# Altium schematic sheet XC7A35TFTG256_bank35.SchDoc
size A4; DocumentNumber: 20; SheetNumber: 20; SheetTotal: 21; SheetName: FPGA Bank 35
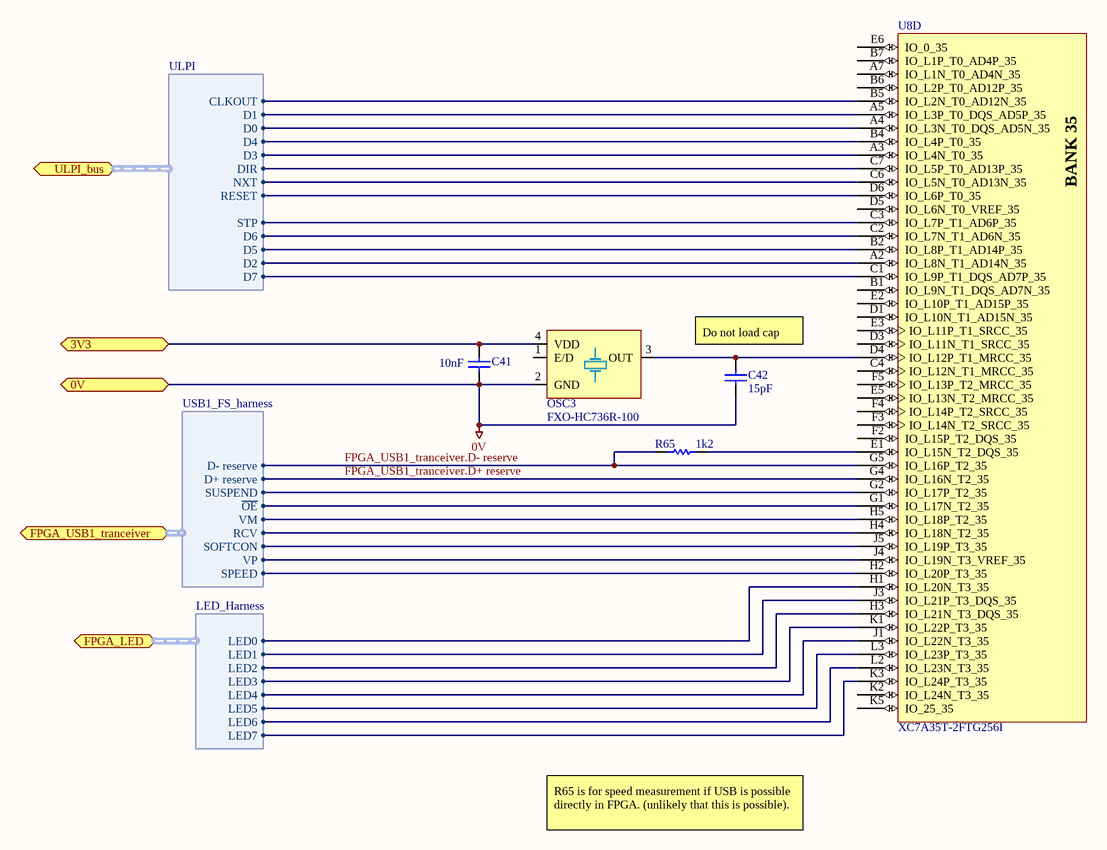
[diagram p0: XC7A35TFTG256_bank35.SchDoc]

## Parts
C41  value 10nF  [CAPC0603(1608)100_L]  (hidden comment: CAP 10nF 16V 0603(1608))
C42  value 15pF  [CAPC0603(1608)100_N]  (hidden comment: CAP 15pF 16V 0603(1608))
OSC3  FXO-HC736R-100  [FXO-HC73]
R65  value 1k2  [RESC0603(1608)_M]  (hidden comment: 1K2 1% 0603(1608))
U8  XC7A35T-2FTG256I  [FTG256]  (part D of 8)

## Ports
0V, 3V3, FPGA_LED (harness LED_Harness), FPGA_USB1_tranceiver (harness USB1_FS_harness), ULPI_bus (harness ULPI)

## Harnesses
ULPI: D0, D1, D2, D3, D4, D5, D6, D7, CLKOUT, STP, DIR, NXT, RESET
LED_Harness: LED0, LED1, LED2, LED3, LED4, LED5, LED6, LED7
USB1_FS_harness: VM, VP, RCV, SOFTCON, SPEED, ~{OE}, SUSPEND, D- reserve, D+ reserve

## Nets
0V: C41.1 C42.1 OSC3.2(GND) ; port 0V
3V3: C41.2 OSC3.4(VDD) ; port 3V3
FPGA_USB1_tranceiver.D+ reserve: U8.G4(IO_L16N_T2_35) ; port FPGA_USB1_tranceiver.D+ reserve
FPGA_USB1_tranceiver.D- reserve: R65.1 U8.G5(IO_L16P_T2_35) ; port FPGA_USB1_tranceiver.D- reserve
NetC42_2: C42.2 OSC3.3(OUT) U8.D4(IO_L12P_T1_MRCC_35)
NetR65_2: R65.2 U8.E1(IO_L15N_T2_DQS_35)
NetU8_A2: U8.A2(IO_L8N_T1_AD14N_35) ; port ULPI_bus.D2
NetU8_A3: U8.A3(IO_L4N_T0_35) ; port ULPI_bus.D3
NetU8_A4: U8.A4(IO_L3N_T0_DQS_AD5N_35) ; port ULPI_bus.D0
NetU8_A5: U8.A5(IO_L3P_T0_DQS_AD5P_35) ; port ULPI_bus.D1
NetU8_B2: U8.B2(IO_L8P_T1_AD14P_35) ; port ULPI_bus.D5
NetU8_B4: U8.B4(IO_L4P_T0_35) ; port ULPI_bus.D4
NetU8_B5: U8.B5(IO_L2N_T0_AD12N_35) ; port ULPI_bus.CLKOUT
NetU8_C1: U8.C1(IO_L9P_T1_DQS_AD7P_35) ; port ULPI_bus.D7
NetU8_C2: U8.C2(IO_L7N_T1_AD6N_35) ; port ULPI_bus.D6
NetU8_C3: U8.C3(IO_L7P_T1_AD6P_35) ; port ULPI_bus.STP
NetU8_C6: U8.C6(IO_L5N_T0_AD13N_35) ; port ULPI_bus.NXT
NetU8_C7: U8.C7(IO_L5P_T0_AD13P_35) ; port ULPI_bus.DIR
NetU8_D6: U8.D6(IO_L6P_T0_35) ; port ULPI_bus.RESET
NetU8_G1: U8.G1(IO_L17N_T2_35) ; port FPGA_USB1_tranceiver.~{OE}
NetU8_G2: U8.G2(IO_L17P_T2_35) ; port FPGA_USB1_tranceiver.SUSPEND
NetU8_H1: U8.H1(IO_L20N_T3_35) ; port FPGA_LED.LED0
NetU8_H2: U8.H2(IO_L20P_T3_35) ; port FPGA_USB1_tranceiver.SPEED
NetU8_H3: U8.H3(IO_L21N_T3_DQS_35) ; port FPGA_LED.LED2
NetU8_H4: U8.H4(IO_L18N_T2_35) ; port FPGA_USB1_tranceiver.RCV
NetU8_H5: U8.H5(IO_L18P_T2_35) ; port FPGA_USB1_tranceiver.VM
NetU8_J1: U8.J1(IO_L22N_T3_35) ; port FPGA_LED.LED4
NetU8_J3: U8.J3(IO_L21P_T3_DQS_35) ; port FPGA_LED.LED1
NetU8_J4: U8.J4(IO_L19N_T3_VREF_35) ; port FPGA_USB1_tranceiver.VP
NetU8_J5: U8.J5(IO_L19P_T3_35) ; port FPGA_USB1_tranceiver.SOFTCON
NetU8_K1: U8.K1(IO_L22P_T3_35) ; port FPGA_LED.LED3
NetU8_K3: U8.K3(IO_L24P_T3_35) ; port FPGA_LED.LED7
NetU8_L2: U8.L2(IO_L23N_T3_35) ; port FPGA_LED.LED6
NetU8_L3: U8.L3(IO_L23P_T3_35) ; port FPGA_LED.LED5

Not connected (* = marked no-connect by the designer): OSC3 1(E/D); U8 A7(IO_L1N_T0_AD4N_35) B1(IO_L9N_T1_DQS_AD7N_35) B6(IO_L2P_T0_AD12P_35) B7(IO_L1P_T0_AD4P_35) C4(IO_L12N_T1_MRCC_35) D1(IO_L10N_T1_AD15N_35) D3(IO_L11N_T1_SRCC_35) D5(IO_L6N_T0_VREF_35) E2(IO_L10P_T1_AD15P_35) E3(IO_L11P_T1_SRCC_35) E5(IO_L13N_T2_MRCC_35) E6(IO_0_35) F2(IO_L15P_T2_DQS_35) F3(IO_L14N_T2_SRCC_35) F4(IO_L14P_T2_SRCC_35) F5(IO_L13P_T2_MRCC_35) K2(IO_L24N_T3_35) K5(IO_25_35)

## Notes on the sheet
- (near C42) Do not load cap
- R65 is for speed measurement if USB is possible directly in FPGA. (unlikely that this is possible).
- Board:
- Version:
- Sheetname:
- Subject:
- Group:
- Sheet
- of
- Shematic file:
- (in symbol CMP-0383-00025-1, part D) BANK 35

## Library data of the parts
C41 = CMP-1035-02309-1: CAP 10nF 16V ±1% 0603 (1608 Metric) Thickness 1mm SMD; Case-Metric: 1608; Tolerance: Â±1%; Case-EIA: 0603; Rated Voltage: 16 V; Technology: SMT; Max Thickness: 1 mm
C42 = CMP-1035-00665-1: CAP 15pF 16V ±0.25pF 0603 (1608 Metric) Thickness 1mm SMD; Case-Metric: 1608; Case-EIA: 0603; Tolerance: Â±0.25pF; Technology: SMT; Max Thickness: 1 mm; Rated Voltage: 16 V
R65 = CMP-1012-00518-1: 1K2 0.1W 1% 0603 (1608 Metric)  SMD; Case-EIA: 0603; Case-Metric: 1608; Power: 0.1 W; Technology: SMT; Tolerance: 1 %
U8 = CMP-0383-00025-1: Artix-7 FPGA, 170 User I/Os, 0 GTP, 256-Ball BGA, Speed Grade 2, Industrial Grade, Pb-Free; Manufacturer: Xilinx; Logic Cells: 33280; GTP: 0; CMTs: 5; Available User I/O: 170; Total Block RAM: 1800 Kb; Speed Grades: 2; ComponentLink3Description: Pinout; ComponentLink4Description: Package Specification; ComponentLink2URL: http://www.xilinx.com/support/documentation/data_sheets/ds180_7Series_Overview.pdf; DatasheetVersion: Rev. 1.15; PackageVersion: Rev. 1.11; ComponentLink3URL: http://www.xilinx.com/support/documentation/user_guides/ug475_7Series_Pkg_Pinout.pdf; ComponentLink1Description: Manufacturer URL; PackageReference: FTG-256; ComponentLink1URL: http://www.xilinx.com/; ComponentLink4URL: http://www.xilinx.com/support/documentation/user_guides/ug475_7Series_Pkg_Pinout.pdf; Mounting Technology: Surface Mount; Maximum Distributed RAM: 400 Kb; PackageDescription: 256-Ball Wire-Bond Fine-Pitch Thin BGA, Body 17 x 17 mm, Pitch 1 mm; ComponentLink2Description: Datasheet; Operating Temperature Range: Industrial; PartNumber: XC7A35T-2FTG256I; PartId: 1
OSC3 = FXO-HC736R-100: Supplier 1: Digi-Key; Supplier Part Number 1: 631-1176-1-ND